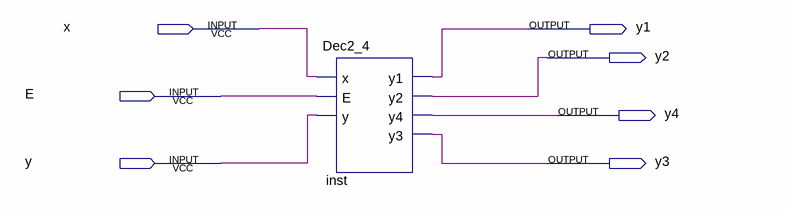
[diagram p0: schematic sheet]
// Quartus schematic DecoderDemo.bdf as structural Verilog: 1 symbols, 7 pins
module DecoderDemo (
  input  x,
  input  E,
  input  y,
  output y1,
  output y2,
  output y4,
  output y3
);

  Dec2_4 inst (.x(x), .E(E), .y(y), .y1(y1), .y2(y2), .y4(y4), .y3(y3));
endmodule
